# EAGLE design roomautomationfinal (EAGLE 8.2.2)
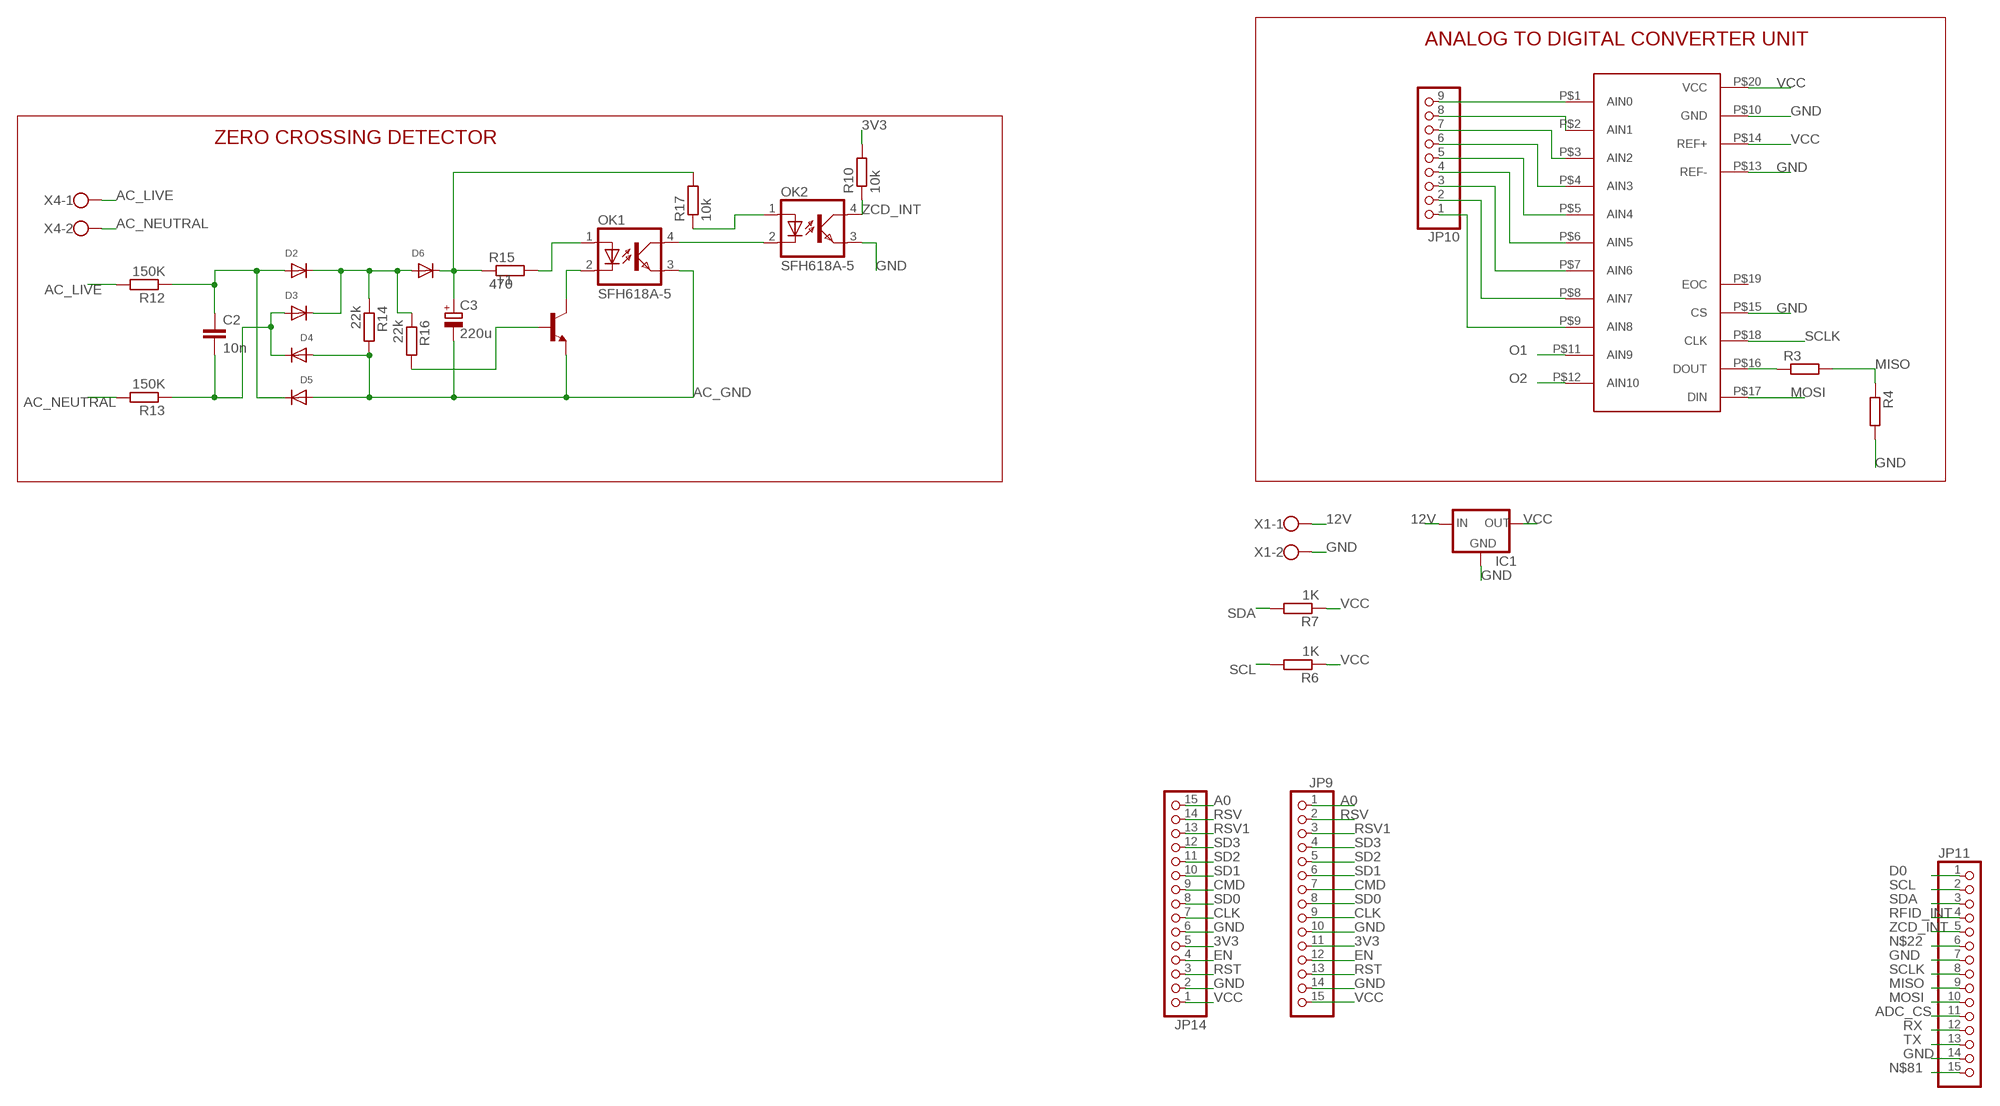
[diagram p0: schematic, sheet 1, part 1 of 2]
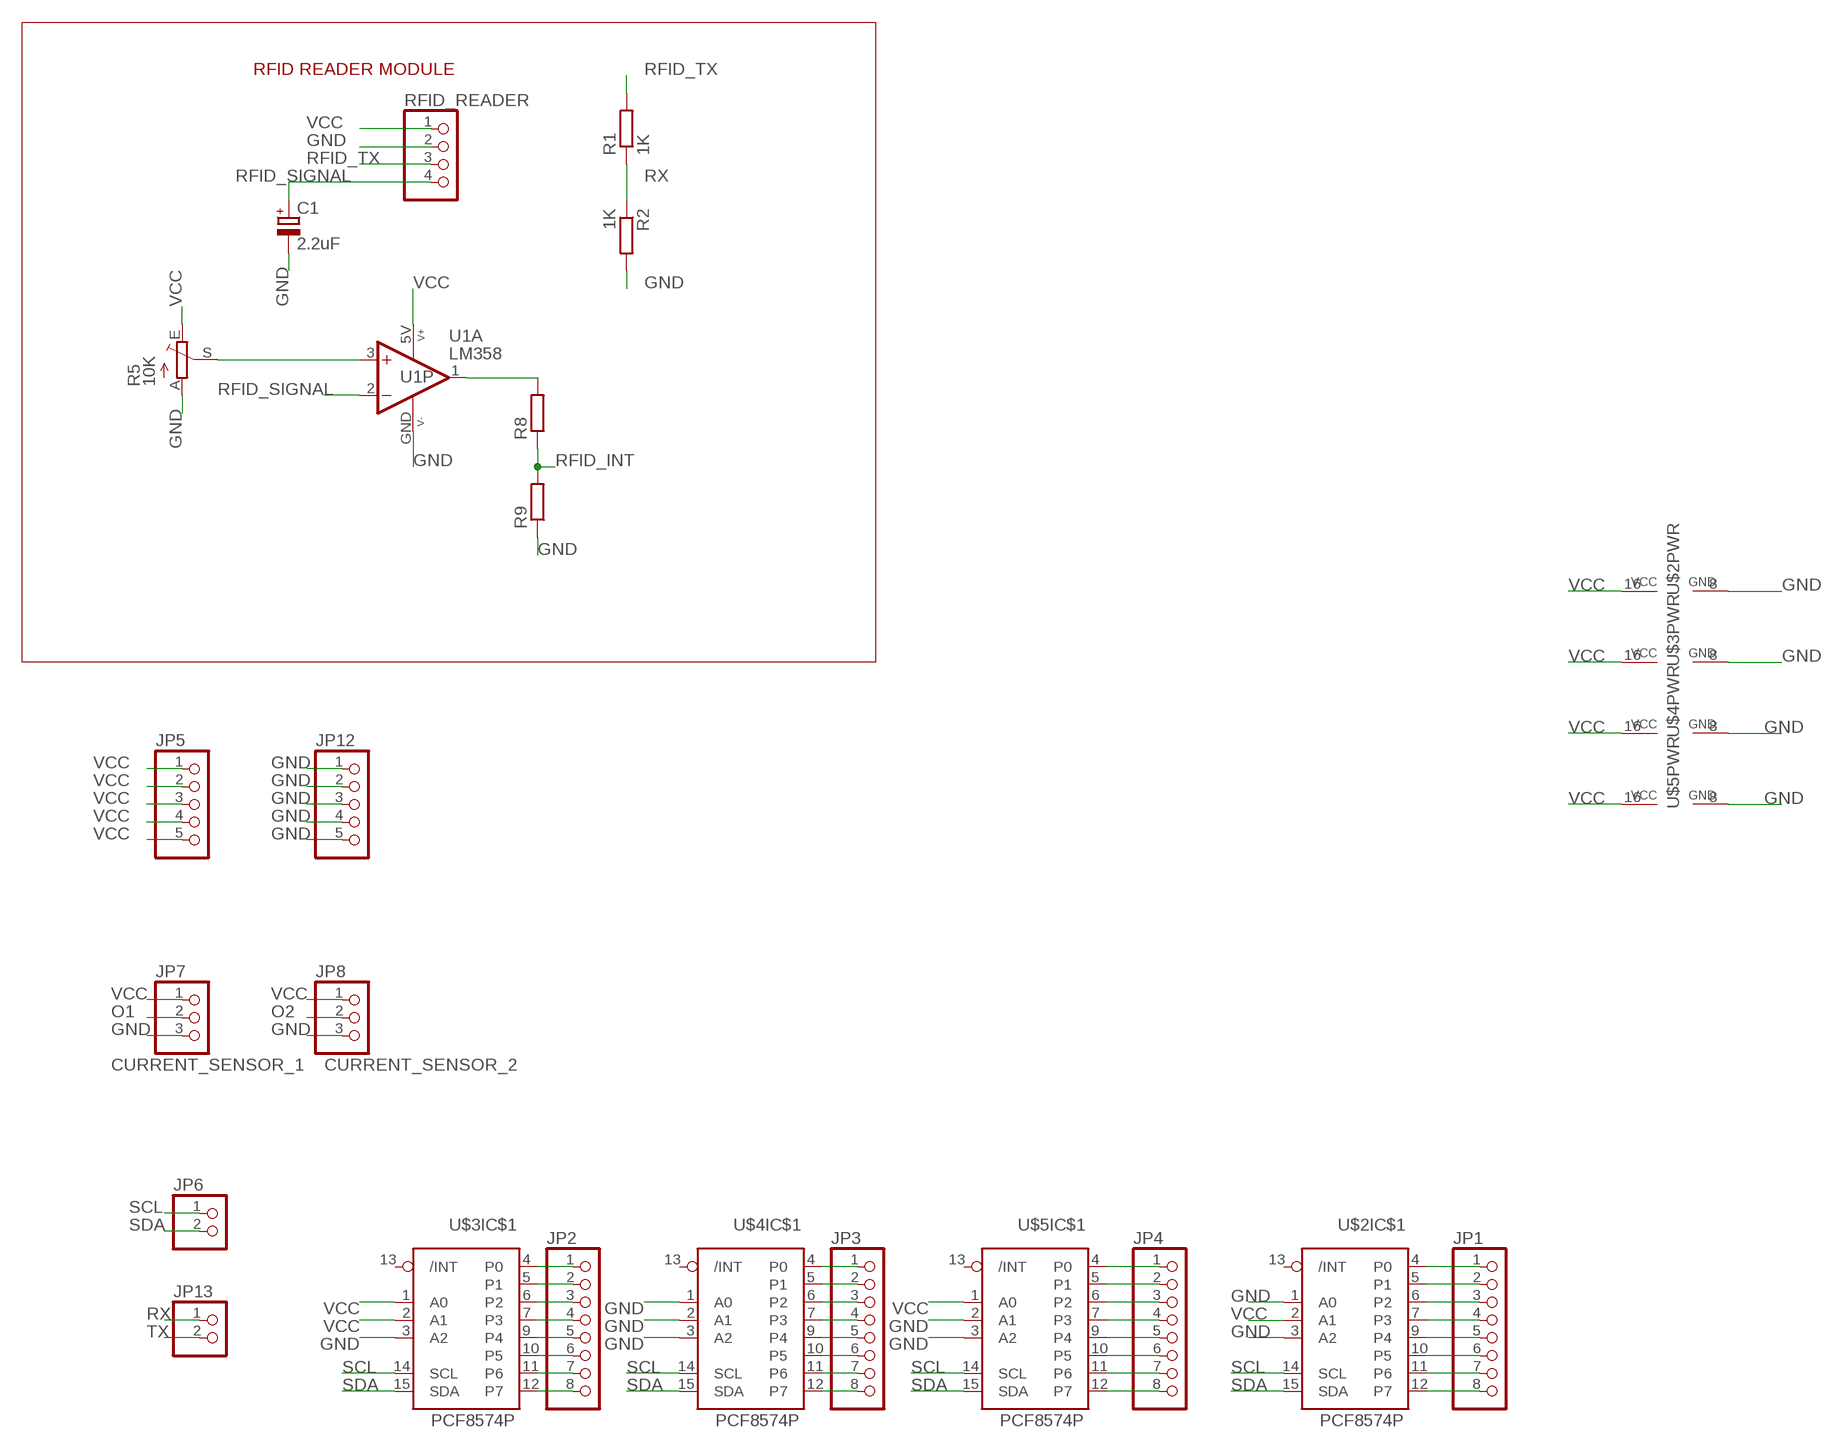
[diagram p1: schematic, sheet 1, part 2 of 2]

## Parts
C1  2.2uF  CPOL-EUE2.5-5  [E2,5-5]
C2  10n  C-EU150-054X183  [C150-054X183]
C3  220u  CPOL-EUE5-10.5  [E5-10,5]
D2  DIODEDO-1N4148  [DO-1N4148]
D3  DIODEDO-1N4148  [DO-1N4148]
D4  DIODEDO-1N4148  [DO-1N4148]
D5  DIODEDO-1N4148  [DO-1N4148]
D6  DIODEDO-1N4148  [DO-1N4148]
IC1  78MXXS  [78MXXS]
JP1  HEADER-1X8  [1X08_OVAL]
JP2  HEADER-1X8  [1X08_OVAL]
JP3  HEADER-1X8  [1X08_OVAL]
JP4  HEADER-1X8  [1X08_OVAL]
JP5  PINHD-1X5  [1X05]
JP6  PINHD-1X2  [1X02]
JP7  PINHD-1X3  [1X03]
JP8  PINHD-1X3  [1X03]
JP9  PINHD-1X15  [1X15]
JP10  PINHD-1X9  [1X09]
JP11  PINHD-1X15  [1X15]
JP12  PINHD-1X5  [1X05]
JP13  PINHD-1X2  [1X02]
JP14  PINHD-1X15  [1X15]
OK1  SFH618A-5  [DIP4]
OK2  SFH618A-5  [DIP4]
R1  1K  R-EU_0207/10  [0207/10]
R2  1K  R-EU_0207/10  [0207/10]
R3  R-EU_0207/10  [0207/10]
R4  R-EU_0207/10  [0207/10]
R5  10K  TRIM_EU-B25P  [B25P]
R6  1K  R-EU_0207/10  [0207/10]
R7  1K  R-EU_0207/10  [0207/10]
R8  R-EU_0207/10  [0207/10]
R9  R-EU_0207/10  [0207/10]
R10  10k  R-EU_0207/10  [0207/10]
R12  150K  R-EU_0207/10  [0207/10]
R13  150K  R-EU_0207/10  [0207/10]
R14  22k  R-EU_0207/10  [0207/10]
R15  470  R-EU_0617/5V  [0617V]
R16  22k  R-EU_0207/10  [0207/10]
R17  10k  R-EU_0617/5V  [0617V]
RFID_READER  HEADER-1X4  [1X04_OVAL]
T1  -NPN-TO92-CBE  [TO92-CBE]
U1  LM358  NE5532N  [DIL08]
U$2  PCF8574P  [DIL16]
U$3  PCF8574P  [DIL16]
U$4  PCF8574P  [DIL16]
U$5  PCF8574P  [DIL16]
U$6  TLC2543  [TLC2543]
X1  W237-102  [W237-102]
X4  W237-102  [W237-102]

## Nets
3V3: JP9.11 JP14.5 R10.2
12V: IC1.IN X1.1
A0: JP9.1 JP14.15
AC_GND: C3.- D4.A D5.A OK1.3(EMIT) R14.2 T1.E
AC_LIVE: R12.2 X4.1
AC_NEUTRAL: R13.2 X4.2
ADC_CS: JP11.11
CLK: JP9.9 JP14.7
CMD: JP9.7 JP14.9
D0: JP11.1
EN: JP9.12 JP14.4
GND: C1.- IC1.GND JP7.3 JP8.3 JP9.10 JP9.14 JP11.7 JP11.14 JP12.1 JP12.2 JP12.3 JP12.4 JP12.5 JP14.2 JP14.6 OK2.3(EMIT) R2.2 R4.2 R5.A R9.1 RFID_READER.2 U1.GND(P:V-) U$2.1(IC$1:A0) U$2.3(IC$1:A2) U$2.8(PWR:GND) U$3.3(IC$1:A2) U$3.8(PWR:GND) U$4.1(IC$1:A0) U$4.2(IC$1:A1) U$4.3(IC$1:A2) U$4.8(PWR:GND) U$5.2(IC$1:A1) U$5.3(IC$1:A2) U$5.8(PWR:GND) U$6.P$10(GND) U$6.P$13(REF-) U$6.P$15(CS) X1.2
MISO: JP11.9 R3.2 R4.1
MOSI: JP11.10 U$6.P$17(DIN)
N$2: R3.1 U$6.P$16(DOUT)
N$5: JP10.9 U$6.P$1(AIN0)
N$6: JP10.8 U$6.P$2(AIN1)
N$7: JP10.7 U$6.P$3(AIN2)
N$8: JP10.6 U$6.P$4(AIN3)
N$9: JP10.5 U$6.P$5(AIN4)
N$10: JP10.4 U$6.P$6(AIN5)
N$11: JP10.3 U$6.P$7(AIN6)
N$12: JP10.2 U$6.P$8(AIN7)
N$13: JP10.1 U$6.P$9(AIN8)
N$16: C2.1 D2.A D5.C R12.1
N$18: C2.2 D3.A D4.C R13.1
N$19: R5.S U1.3(A:+IN)
N$21: D2.C D3.C D6.A R14.1 R16.1
N$22: JP11.6
N$24: R8.2 U1.1(A:OUT)
N$25: JP1.1 U$2.4(IC$1:P0)
N$27: JP1.2 U$2.5(IC$1:P1)
N$28: JP1.3 U$2.6(IC$1:P2)
N$29: C3.+ D6.C R15.1 R17.2
N$30: JP1.4 U$2.7(IC$1:P3)
N$31: JP1.5 U$2.9(IC$1:P4)
N$32: JP1.6 U$2.10(IC$1:P5)
N$33: R16.2 T1.B
N$34: JP1.7 U$2.11(IC$1:P6)
N$35: JP1.8 U$2.12(IC$1:P7)
N$36: JP2.1 U$3.4(IC$1:P0)
N$37: JP2.2 U$3.5(IC$1:P1)
N$38: JP2.3 U$3.6(IC$1:P2)
N$39: JP2.4 U$3.7(IC$1:P3)
N$40: JP2.5 U$3.9(IC$1:P4)
N$41: JP2.6 U$3.10(IC$1:P5)
N$42: JP2.7 U$3.11(IC$1:P6)
N$43: JP2.8 U$3.12(IC$1:P7)
N$44: JP3.1 U$4.4(IC$1:P0)
N$45: JP3.2 U$4.5(IC$1:P1)
N$46: JP3.3 U$4.6(IC$1:P2)
N$47: JP3.4 U$4.7(IC$1:P3)
N$48: JP3.5 U$4.9(IC$1:P4)
N$49: JP3.6 U$4.10(IC$1:P5)
N$50: JP3.7 U$4.11(IC$1:P6)
N$51: JP3.8 U$4.12(IC$1:P7)
N$52: JP4.1 U$5.4(IC$1:P0)
N$53: JP4.2 U$5.5(IC$1:P1)
N$54: JP4.3 U$5.6(IC$1:P2)
N$55: JP4.4 U$5.7(IC$1:P3)
N$56: JP4.5 U$5.9(IC$1:P4)
N$57: JP4.6 U$5.10(IC$1:P5)
N$58: JP4.7 U$5.11(IC$1:P6)
N$59: JP4.8 U$5.12(IC$1:P7)
N$65: OK2.1(A) R17.1
N$66: OK1.4(COL) OK2.2(C)
N$69: OK1.1(A) R15.2
N$70: OK1.2(C) T1.C
N$81: JP11.15
O1: JP7.2 U$6.P$11(AIN9)
O2: JP8.2 U$6.P$12(AIN10)
RFID_INT: JP11.4 R8.1 R9.2
RFID_SIGNAL: C1.+ RFID_READER.4 U1.2(A:-IN)
RFID_TX: R1.2 RFID_READER.3
RST: JP9.13 JP14.3
RSV: JP9.2 JP14.14
RSV1: JP9.3 JP14.13
RX: JP11.12 JP13.1 R1.1 R2.1
SCL: JP6.1 JP11.2 R6.2 U$2.14(IC$1:SCL) U$3.14(IC$1:SCL) U$4.14(IC$1:SCL) U$5.14(IC$1:SCL)
SCLK: JP11.8 U$6.P$18(CLK)
SD0: JP9.8 JP14.8
SD1: JP9.6 JP14.10
SD2: JP9.5 JP14.11
SD3: JP9.4 JP14.12
SDA: JP6.2 JP11.3 R7.2 U$2.15(IC$1:SDA) U$3.15(IC$1:SDA) U$4.15(IC$1:SDA) U$5.15(IC$1:SDA)
TX: JP11.13 JP13.2
VCC: IC1.OUT JP5.1 JP5.2 JP5.3 JP5.4 JP5.5 JP7.1 JP8.1 JP9.15 JP14.1 R5.E R6.1 R7.1 RFID_READER.1 U1.5V(P:V+) U$2.2(IC$1:A1) U$2.16(PWR:VCC) U$3.1(IC$1:A0) U$3.2(IC$1:A1) U$3.16(PWR:VCC) U$4.16(PWR:VCC) U$5.1(IC$1:A0) U$5.16(PWR:VCC) U$6.P$14(REF+) U$6.P$20(VCC)
ZCD_INT: JP11.5 OK2.4(COL) R10.1
Unconnected: U1.5(B:+IN) U1.6(B:-IN) U1.7(B:OUT) U$2.13(IC$1:/INT) U$3.13(IC$1:/INT) U$4.13(IC$1:/INT) U$5.13(IC$1:/INT) U$6.P$19(EOC)

## Notes on the sheet
- ANALOG TO DIGITAL CONVERTER UNIT
- RFID READER MODULE
- ZERO CROSSING DETECTOR
- CURRENT_SENSOR_1 | CURRENT_SENSOR_2

## Library data of the parts
C1 = resistor:CPOL-EU: POLARIZED CAPACITOR, European symbol
C2 = rcl:C-EU: CAPACITOR, European symbol
C3 = rcl:CPOL-EU: POLARIZED CAPACITOR, European symbol
D2-D6 = adafruit:DIODE: Diode SMADIODE - SMA Surface Mount Package 20V 1A Schottky Diode Digikey: 641-1014-6-ND DO-1N4148 - Through Hole Small Current Diode SOD-123 20V 1 A (.5mV Vf) Schottky Diode - Digikey: MBRX120TPMSCT-ND SOD-323 10V 570mA (.38mV Vf, 3ns) Schottky Diode - Digikey: ZLLS410CT-ND SOD-523 30V 30mA Schottky Diode (RB751S-40TE61) - Digikey: RB751S-40TE61CT-ND SOT23-R/W - SOT23 Package (R = Solder Paste/Reflow Ovens, W = Hand-Soldering) BAT54Film 40V 300mA - Digikey: 497-7162-1-ND
IC1 = v-reg-3:78MXXS: VOLTAGE REGULATOR
JP1-JP4 = microbuilder:HEADER-1X8: PIN HEADER
JP5 JP12 = pinhead:PINHD-1X5: PIN HEADER
JP6 JP13 = pinhead:PINHD-1X2: PIN HEADER
JP7 JP8 = adafruit:PINHD-1X3: PIN HEADER
JP9 = adafruit:PINHD-1X15: PIN HEADER
JP10 = pinhead:PINHD-1X9: PIN HEADER
JP11 JP14 = pinhead:PINHD-1X15: PIN HEADER
OK1 OK2 = optocoupler:SFH618?*: Optocoupler, Phototransistor Output, Low Input Current Source: Data sheet <http://www.vishay.com/docs/83673/sfh618.pdf>; MF: VISHAY/TELEFUNKEN; MPN: SFH618A-5; OC_FARNELL: 1469593; OC_NEWARK: 59K0259
R1-R4 R6-R10 R12-R17 = rcl:R-EU_: RESISTOR, European symbol
R5 = pot:TRIM_EU-: POTENTIOMETER
RFID_READER = microbuilder:HEADER-1X4: PIN HEADER
T1 = transistor-neu-to92:*-NPN-: NPN Transistror
U1 = op-amp:NE5532: OP-AMP
U$2-U$5 = i2c:PCF8574: Remote 8-Bit I/O Expander for I²C Bus
U$6 = TLC2543:TLC2543
X1 X4 = con-wago-500:W237-102: WAGO SCREW CLAMP; MPN: 237-102; OC_FARNELL: unknown; OC_NEWARK: 70K9898

## Board
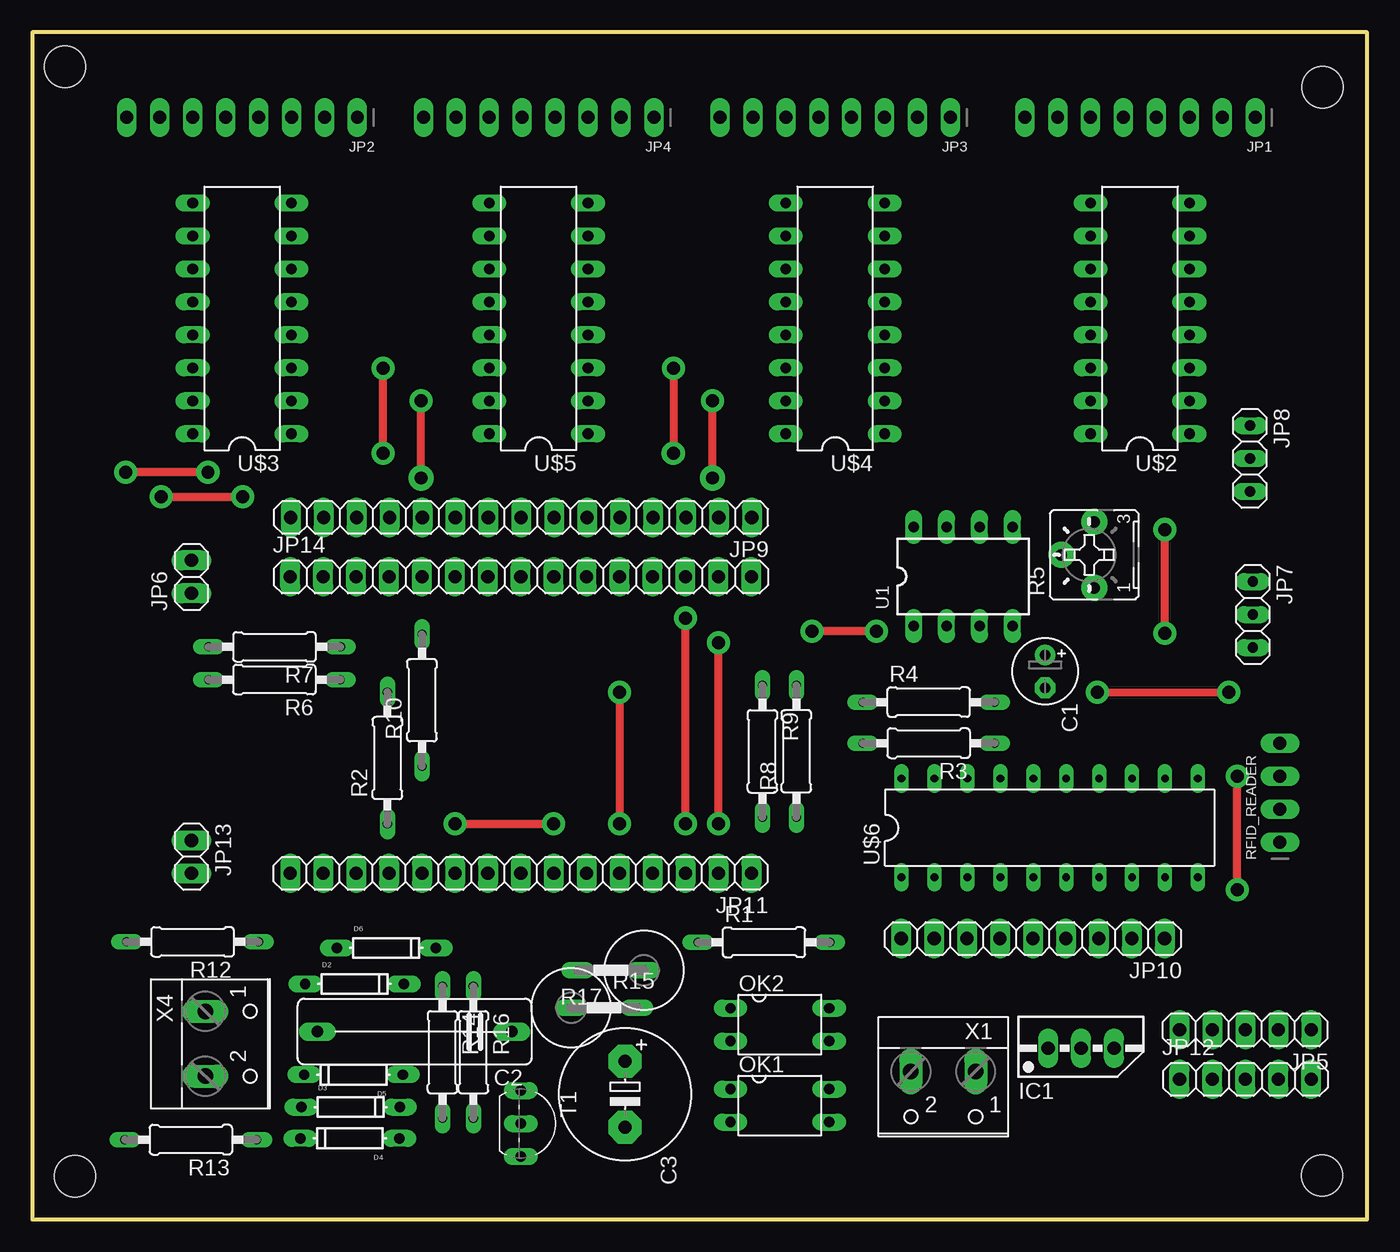
[diagram p2: board, top side]
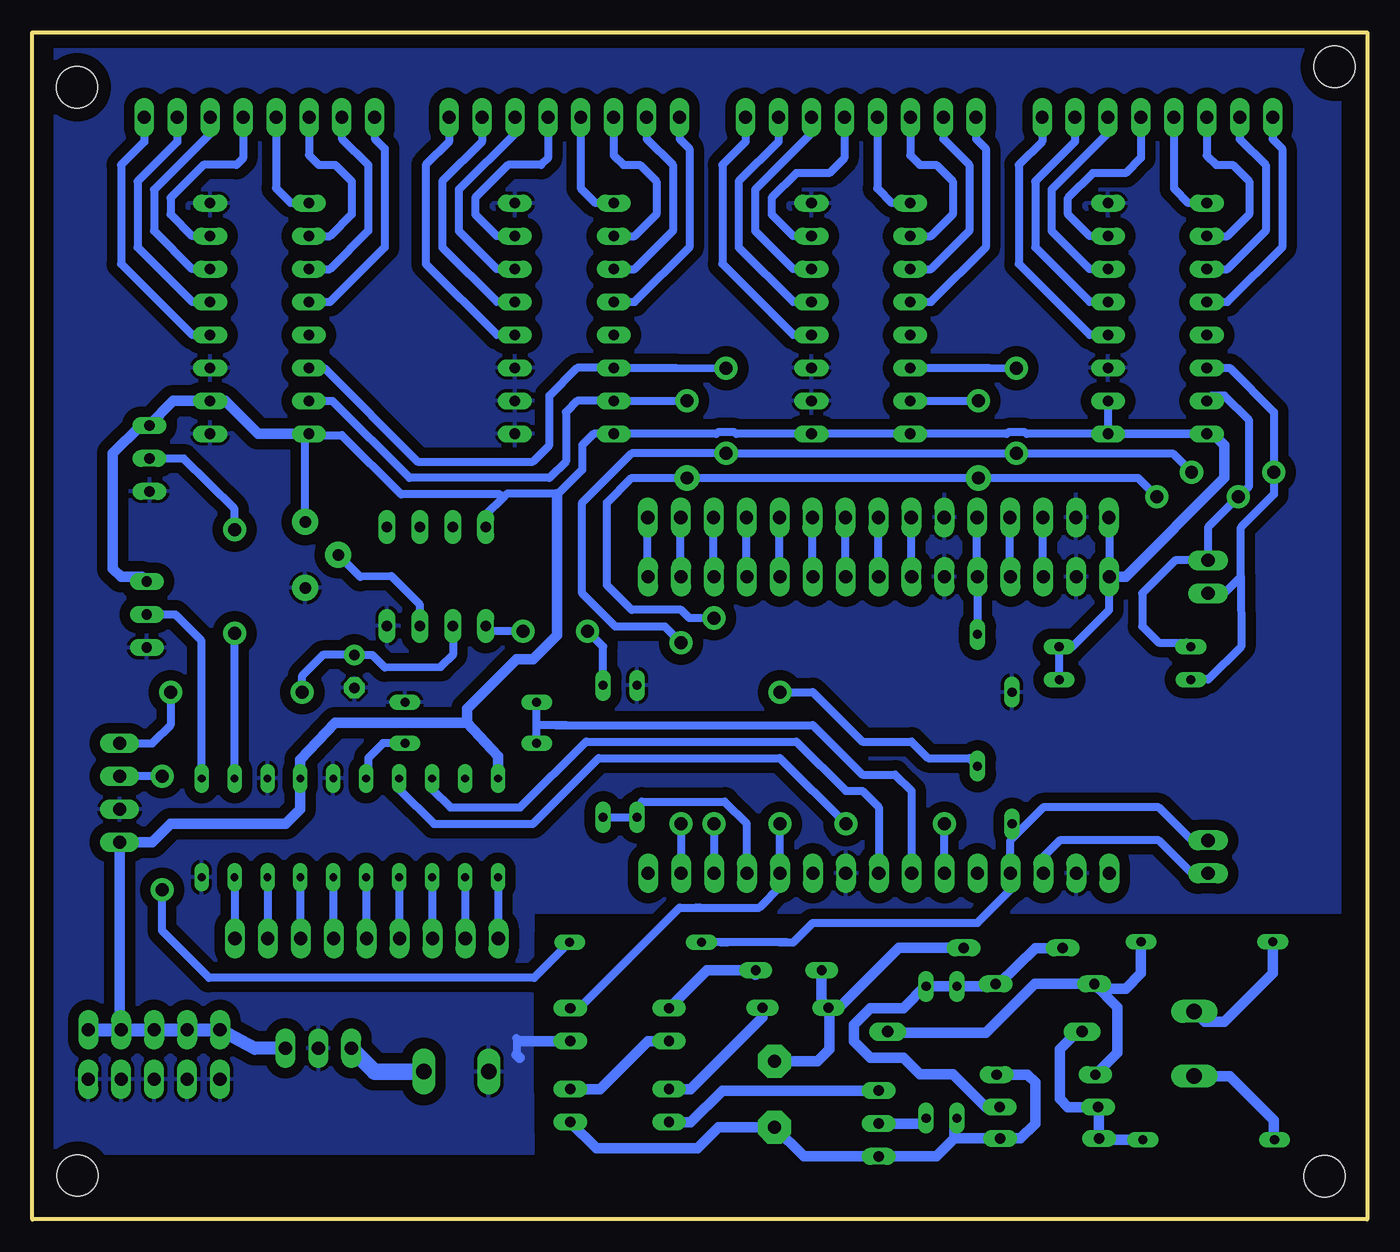
[diagram p3: board, bottom side, seen from below]

Size 102.93 x 91.5 mm. Coordinates in mm from the lower left corner, seen from the top.
Outline: 0,0 102.93,0 102.93,91.5 0,91.5 0,0
Copper layers (1*16): Top 0.035mm / dielectric 1.5mm / Bottom 0.035mm
Design rules "default *": minimum track width 6mil, minimum drill 0.35mm, track to track 16mil, track to pad 16mil, pad to pad 16mil, via to via 16mil, smd to smd 16mil, copper to edge 40mil, drill to drill 50mil, minimum pad ring 10mil, minimum via ring 8mil, stop-mask expansion 4mil, vias tented up to drill 0mil, thermal gap 10mil
Holes 3.2 mm at 99.5,87.27 99.46,3.37 2.5,88.86 3.29,3.33

### Footprints (pad centres in the part's own frame; a part is rotated, then mirrored left to right if it is on the bottom)
E2,5-5 = drill 0.813 pad 1.6: + -1.27,0 | drill 0.813 pad 1.6 octagon: - 1.27,0
C150-054X183 = drill 0.9 long: 1 -7.493,0; 2 7.493,0
E5-10,5 = drill 1.016 pad 2.54 octagon: + -2.54,0; - 2.54,0
DO-1N4148 = drill 0.8 long: A -3.81,0; C 3.81,0
78MXXS = drill 1.016 long: GND 0,-2.54; IN -2.54,-2.54; OUT 2.54,-2.54
1X08_OVAL = drill 1 long: 1 -8.89,0; 2 -6.35,0; 3 -3.81,0; 4 -1.27,0; 5 1.27,0; 6 3.81,0; 7 6.35,0; 8 8.89,0
1X05 = drill 1.016 long: 1 -5.08,0; 2 -2.54,0; 3 0,0; 4 2.54,0; 5 5.08,0
1X02 = drill 1.016 long: 1 -1.27,0; 2 1.27,0
1X03 = drill 0.8 long: 1 -2.54,0; 2 0,0; 3 2.54,0
1X15 = drill 1.016 long: 1 -17.78,0; 2 -15.24,0; 3 -12.7,0; 4 -10.16,0; 5 -7.62,0; 6 -5.08,0; 7 -2.54,0; 8 0,0; 9 2.54,0; 10 5.08,0; 11 7.62,0; 12 10.16,0; 13 12.7,0; 14 15.24,0; 15 17.78,0
1X09 = drill 1.016 long: 1 -10.16,0; 2 -7.62,0; 3 -5.08,0; 4 -2.54,0; 5 0,0; 6 2.54,0; 7 5.08,0; 8 7.62,0; 9 10.16,0
DIP4 = drill 0.8 long: 1 -1.27,-3.81; 2 1.27,-3.81; 3 1.27,3.81; 4 -1.27,3.81
0207/10 = drill 0.7 long: 1 -5.08,0; 2 5.08,0
B25P = drill 0.9 pad 2: A -2.54,0; E 2.54,0; S 0,2.54
0617V = drill 0.75 long: 1 -2.54,0; 2 2.54,0
1X04_OVAL = drill 1 long: 1 -3.81,0; 2 -1.27,0; 3 1.27,0; 4 3.81,0
TO92-CBE = drill 0.813 long: B 0,0; C -2.54,0; E 2.54,0
DIL08 = drill 0.813 long: 1 -3.81,-3.81; 2 -1.27,-3.81; 3 1.27,-3.81; 5 3.81,3.81; 5V -3.81,3.81; 6 1.27,3.81; 7 -1.27,3.81; GND 3.81,-3.81
DIL16 = drill 0.813 long: 1 -8.89,-3.81; 2 -6.35,-3.81; 3 -3.81,-3.81; 4 -1.27,-3.81; 5 1.27,-3.81; 6 3.81,-3.81; 7 6.35,-3.81; 8 8.89,-3.81; 9 8.89,3.81; 10 6.35,3.81; 11 3.81,3.81; 12 1.27,3.81; 13 -1.27,3.81; 14 -3.81,3.81; 15 -6.35,3.81; 16 -8.89,3.81
TLC2543 = drill 0.6 long: P$1 -8.89,-3.81; P$2 -6.35,-3.81; P$3 -3.81,-3.81; P$4 -1.27,-3.81; P$5 1.27,-3.81; P$6 3.81,-3.81; P$7 6.35,-3.81; P$8 8.89,-3.81; P$9 11.43,-3.81; P$10 13.97,-3.81; P$11 13.97,3.81; P$12 11.43,3.81; P$13 8.89,3.81; P$14 6.35,3.81; P$15 3.81,3.81; P$16 1.27,3.81; P$17 -1.27,3.81; P$18 -3.81,3.81; P$19 -6.35,3.81; P$20 -8.89,3.81
W237-102 = drill 1.194 long: 1 -2.5,-1.27; 2 2.5,-1.27

### Placement (x,y rotation side)
C1  78.1,42.24 270 top
C2  29.48,14.47 180 top
C3  45.7,9.64 270 top
D2  24.84,18.14 0 top
D3  24.54,8.65 0 top
D4  24.48,6.24 180 top
D5  24.77,11.14 180 top
D6  27.29,20.92 0 top
IC1  80.88,15.72 0 top
JP1  85.42,84.95 180 top
JP2  16.17,84.95 180 top
JP3  61.91,84.95 180 top
JP4  39.04,84.95 180 top
JP5  93.55,14.6 180 top
JP6  12.27,49.53 90 top
JP7  94.11,46.62 270 top
JP8  93.89,58.66 270 top
JP9  37.7,54.11 180 top
JP10  77.16,21.64 180 top
JP11  37.66,26.67 180 top
JP12  93.55,10.79 0 top
JP13  12.27,27.94 270 top
JP14  37.66,49.53 0 top
OK1  57.65,8.76 270 top
OK2  57.65,15.01 270 top
R1  56.41,21.36 0 top
R2  27.38,35.56 90 top
R3  69.11,36.7 180 top
R4  69.11,39.88 0 top
R5  81.89,51.22 90 top
R6  18.66,41.61 180 top
R7  18.67,44.13 180 top
R8  58.91,36.08 90 top
R9  56.29,36.08 270 top
R10  30.04,40.02 90 top
R12  12.35,21.39 180 top
R13  12.21,6.13 180 top
R14  31.62,12.88 270 top
R15  44.09,16.31 0 top
R16  34,12.88 270 top
R17  44.61,19.2 180 top
RFID_READER  96.2,32.88 90 top
T1  37.66,7.38 270 top
U1  71.78,49.56 0 top
U$2  85.42,69.45 90 top
U$3  16.17,69.45 90 top
U$4  61.91,69.45 90 top
U$5  39.04,69.45 90 top
U$6  75.92,30.18 0 top
X1  70.25,10.12 180 top
X4  14.6,13.53 270 top

### Tracks (layer width: path | path; a pad name or v marks a point on that pad's centre or on a via)
3V3
  Bottom 0.61: 30.05,48.26 JP14.5 | JP14.5 30.07,49.53 JP9.11 | JP14.5 R10.2
12V
  Bottom 1.27: X1.1 76.54,11.39 IC1.IN
A0
  Bottom 0.61: 55.45,54.08 JP9.1 55.48,49.53 JP14.15
AC_GND
  Bottom 0.813: OK1.3 59.44,5.48 51.63,5.48 50.01,7.1 C3.- 43.44,4.84 T1.E 33.22,4.84 31.82,6.24 | D5.A 26.18,11.14 25.6,10.56 25.6,7.38 26.75,6.24 D4.A 31.82,6.24 | 31.82,6.24 31.82,7.6 R14.2
AC_LIVE
  Bottom 0.813: R12.2 7.27,18.96 11,15.24 12.53,15.24 X4.1
AC_NEUTRAL
  Bottom 0.813: X4.2 10.6,11.04 7.19,7.62 7.19,6.18 R13.2
CLK
  Bottom 0.61: JP14.7 35.16,49.53 JP9.9
CMD
  Bottom 0.61: JP14.9 40.23,49.53 JP9.7
EN
  Bottom 0.61: JP14.4 27.54,49.53 JP9.12
GND
  Bottom 0.61: 65.37,13.74 65.6,13.97 65.6,12.7
  Bottom 0.813: 65.6,12.7 65.37,12.46 | OK2.3 65.37,13.74
  pour Bottom (isolate 0.813): 2.1,90.17 101.17,90.17 101.17,5.12 65.88,5.12 64.34,5.08 arc2 64.34,23.7 2.1,23.7
MISO
  Bottom 0.61: R3.2 64.04,38.1 | 62.64,38.1 61.8,38.1 | 61.8,38.1 42.74,38.1 38.94,34.29 36.4,34.29 35.12,33.02 JP11.9 | 61.8,38.1 61.86,38.1 64.04,38.1 | 64.04,38.1 64.03,38.11 R4.1
MOSI  (via drill 1 pad 1.78)
  Top 0.61: v32.59,30.48 v40.2,30.48
  Bottom 0.61: U$6.P$17 74.64,33.17 71.95,30.48 64.34,30.48 59.26,35.56 45.28,35.56 v40.2,30.48 | JP11.10 v32.59,30.48
N$2
  Bottom 0.61: R3.1 75.89,36.7 77.03,35.56 77.03,34.14 U$6.P$16
N$5
  Bottom 0.61: U$6.P$1 67.03,21.67 JP10.9
N$6
  Bottom 0.61: U$6.P$2 69.56,21.67 JP10.8
N$7
  Bottom 0.61: U$6.P$3 72.11,21.67 JP10.7
N$8
  Bottom 0.61: U$6.P$4 74.64,21.67 JP10.6
N$9
  Bottom 0.61: U$6.P$5 77.19,21.67 JP10.5
N$10
  Bottom 0.61: U$6.P$6 79.72,21.67 JP10.4
N$11
  Bottom 0.61: U$6.P$7 82.27,21.67 JP10.3
N$12
  Bottom 0.61: U$6.P$8 84.81,21.67 JP10.2
N$13
  Bottom 0.61: U$6.P$9 87.34,21.67 JP10.1
N$16
  Bottom 0.813: C2.1 36.87,14.37 29.41,14.37 25.64,18.14 D2.A | D5.C 19.25,12.85 19.25,16.36 D2.A | R12.1 17.43,18.96 18.62,17.78 20.67,17.78 D2.A
N$18
  Bottom 0.813: C2.2 22.32,14.47 23.7,13.1 23.7,9.29 23.06,8.65 D3.A 20.67,8.59 D4.C 20.57,6.13 R13.1
N$19
  Bottom 0.61: U1.3 73.05,47.38 75.25,49.58 77.66,49.53 R5.S
N$21
  Bottom 0.813: D3.C 29.41,8.65 31.95,11.2 34.49,11.2 35.76,12.46 38.3,12.46 39.57,13.74 39.57,15.01 38.3,16.28 35.76,16.28 34,18.03 R16.1 R14.1 28.84,17.96 D2.C 28.41,18.14 25.58,20.91 23.43,20.91 D6.A
N$24  (via drill 1 pad 1.78)
  Top 0.61: v65.08,45.35 v60.12,45.35
  Bottom 0.61: 67.95,45.77 U1.1 67.57,45.35 v65.08,45.35 | v60.12,45.35 58.91,44.14 R8.2
N$25
  Bottom 0.61: JP1.1 94.31,83.06 96.08,81.28 96.08,73.66 90.61,68.18 U$2.4
N$27
  Bottom 0.61: JP1.2 91.77,83.06 94.81,80.01 94.81,74.93 90.61,70.72 U$2.5
N$28
  Bottom 0.61: JP1.3 89.22,83.69 93.55,79.38 93.55,76.2 90.61,73.26 U$2.6
N$29
  Bottom 0.813: C3.+ 42.39,12.18 41.48,13.1 41.48,16.24 R15.1 | R17.2 42.07,16.84 R15.1 | D6.C 36.11,20.92 40.72,16.31 R15.1
N$30
  Bottom 0.61: JP1.4 86.69,81.79 87.19,81.28 89.73,81.28 92.28,78.74 92.28,77.47 90.61,75.8 U$2.7
N$31
  Bottom 0.61: JP1.5 84.14,79.5 82.98,78.34 U$2.9
N$32
  Bottom 0.61: JP1.6 81.61,82.04 80.84,81.28 79.58,81.28 78.31,80.01 78.31,77.47 79.97,75.8 U$2.10
N$33
  Bottom 0.813: T1.B 34,7.38 R16.2
N$34
  Bottom 0.61: JP1.7 79.06,83.31 77.03,81.28 77.03,76.2 79.97,73.26 U$2.11
N$35
  Bottom 0.61: JP1.8 76.53,83.31 75.77,82.55 75.77,74.93 79.97,70.72 U$2.12
N$36
  Bottom 0.61: JP2.1 25.06,83.09 26.87,81.28 26.87,73.66 21.39,68.18 U$3.4
N$37
  Bottom 0.61: JP2.2 22.52,83.09 25.6,80.01 25.6,74.93 21.39,70.72 U$3.5
N$38
  Bottom 0.61: U$3.6 21.39,73.26 24.33,76.2 24.33,79.38 19.98,83.72 JP2.3
N$39
  Bottom 0.61: JP2.4 17.44,81.82 18.62,80.64 21.16,80.64 23.06,78.74 23.06,77.47 21.39,75.8 U$3.7
N$40
  Bottom 0.61: JP2.5 14.9,79.47 13.77,78.34 U$3.9
N$41
  Bottom 0.61: JP2.6 12.36,82.01 11.63,81.28 10.36,81.28 9.09,80.01 9.09,77.47 10.76,75.8 U$3.10
N$42
  Bottom 0.61: JP2.7 9.82,83.28 7.82,81.28 7.82,76.2 10.76,73.26 U$3.11
N$43
  Bottom 0.61: JP2.8 7.28,83.28 6.55,82.55 6.55,74.93 10.76,70.72 U$3.12
N$44
  Bottom 0.61: JP3.1 70.8,83.07 72.59,81.28 72.59,73.66 67.11,68.18 U$4.4
N$45
  Bottom 0.61: JP3.2 68.26,83.07 71.32,80.01 71.32,74.93 67.11,70.72 U$4.5
N$46
  Bottom 0.61: U$4.6 67.11,73.26 70.05,76.2 70.05,79.38 65.6,83.82 65.6,84.83 JP3.3
N$47
  Bottom 0.61: JP3.4 63.18,81.8 63.7,81.28 66.24,81.28 68.78,78.74 68.78,77.47 67.11,75.8 U$4.7
N$48
  Bottom 0.61: JP3.5 60.64,79.49 59.49,78.34 U$4.9
N$49
  Bottom 0.61: JP3.6 58.1,82.03 57.35,81.28 56.08,81.28 54.81,80.01 54.81,77.47 56.48,75.8 U$4.10
N$50
  Bottom 0.61: JP3.7 55.56,83.3 53.54,81.28 53.54,76.2 56.48,73.26 U$4.11
N$51
  Bottom 0.61: JP3.8 53.02,83.3 52.27,82.55 52.27,74.93 56.48,70.72 U$4.12
N$52
  Bottom 0.61: JP4.1 47.93,83.08 49.73,81.28 49.73,73.66 44.25,68.18 U$5.4
N$53
  Bottom 0.61: JP4.2 45.39,83.08 48.46,80.01 48.46,74.93 44.25,70.72 U$5.5
N$54
  Bottom 0.61: JP4.3 42.85,83.72 47.19,79.38 47.19,76.2 44.25,73.26 U$5.6
N$55
  Bottom 0.61: JP4.4 40.31,81.81 41.48,80.64 44.02,80.64 45.92,78.74 45.92,77.47 44.25,75.8 U$5.7
N$56
  Bottom 0.61: JP4.5 37.77,79.48 36.63,78.34 U$5.9
N$57
  Bottom 0.61: JP4.6 35.23,82.02 34.49,81.28 33.22,81.28 31.95,80.01 31.95,77.47 33.62,75.8 U$5.10
N$58
  Bottom 0.61: JP4.7 32.69,83.29 30.68,81.28 30.68,76.2 33.62,73.26 U$5.11
N$59
  Bottom 0.61: JP4.8 30.15,83.29 29.41,82.55 29.41,74.93 33.62,70.72 U$5.12
N$65
  Bottom 0.813: 47.15,18.86 R17.1 50.91,19.2 OK2.1
N$66
  Bottom 0.813: OK1.4 59.14,10.04 55.44,13.74 OK2.2
N$69
  Bottom 0.813: R15.2 46.62,15.57 52.16,10.04 OK1.1
N$70
  Bottom 0.813: T1.C 49.73,9.92 52.16,7.49 OK1.2
O1
  Bottom 0.61: U$6.P$11 89.89,44.6 91.89,46.62 93.36,46.62 JP7.2
O2  (via drill 1 pad 1.78)
  Top 0.61: v87.34,45.18 v87.34,53.18
  Bottom 0.61: U$6.P$12 v87.34,45.18 | v87.34,53.18 87.34,54.76 91.25,58.65 JP8.2
RFID_INT
  Bottom 0.61: JP11.4 47.83,30.48 49.54,32.19 55.92,32.19 R9.2 R8.1
RFID_SIGNAL  (via drill 1 pad 1.78)
  Top 0.61: v82.11,40.64 v92.28,40.64
  Bottom 0.61: v92.28,40.64 92.28,38.1 93.69,36.69 RFID_READER.4 | U1.2 70.51,43.52 71.44,42.59 75.77,42.54 76.73,43.51 C1.+ 80.52,43.51 82.11,41.91 v82.11,40.64
RFID_TX  (via drill 1 pad 1.78)
  Top 0.61: v92.91,25.4 v92.91,34.15
  Bottom 0.61: v92.91,25.4 92.93,22.25 89.31,18.61 64.24,18.61 R1.2 | v92.91,34.15 RFID_READER.3
RST
  Bottom 0.61: JP14.3 25,49.53 JP9.13
RSV
  Bottom 0.61: JP14.14 52.94,49.53 JP9.2
RSV1
  Bottom 0.61: JP14.13 50.4,49.53 JP9.3
RX
  Bottom 0.61: 27.38,29.34 24.96,31.75 16.07,31.75 13.54,29.21 JP13.1 | R1.1 49.33,21.36 49.79,21.36 45.28,21.36 | R2.1 27.38,29.34 | 27.38,29.34 27.5,29.21 JP11.12 27.5,25.4 30.05,22.86 42.74,22.86 44.25,21.36 45.28,21.36 | 44.71,21.36 45.28,21.36
SCL  (via drill 1 pad 1.78, 1 pad 1.79)
  Top 0.61: v27.04,59.05 v27.04,65.61 | v49.42,65.61 v49.42,59.05 | v52.91,30.48 v52.91,44.45 | v13.54,57.59 v7.19,57.59
  Bottom 0.61: U$5.14 29.18,65.64 v27.04,65.61 | U$2.14 80.44,65.64 73.22,58.42 64.34,58.42 63.06,59.69 63.06,63.5 60.92,65.64 U$4.14 53.3,65.64 v49.42,65.61 | v52.91,44.45 54.17,45.72 57.98,45.72 60.52,48.26 60.52,55.24 56.72,59.05 v49.42,59.05 v27.04,59.05 15,59.05 v13.54,57.59 | JP6.1 11,48.26 9.72,49.53 | 9.72,49.53 9.72,53.34 7.19,55.88 v7.19,57.59 7.19,62.23 10.59,65.64 U$3.14 | v52.91,30.48 JP11.2 | 9.72,49.53 9.71,44.16 12.26,41.62 13.27,41.62 R6.2
SCLK
  Bottom 0.61: U$6.P$18 72.11,33.17 70.69,31.75 65.3,31.75 60.22,36.83 44.02,36.83 40.2,33.02 38.94,33.02 37.66,31.75 JP11.8
SD0
  Bottom 0.61: JP14.8 37.7,49.53 JP9.8
SD1
  Bottom 0.61: JP14.10 42.77,49.53 JP9.6
SD2
  Bottom 0.61: JP14.11 45.31,49.53 JP9.5
SD3
  Bottom 0.61: JP14.12 47.85,49.53 JP9.4
SDA  (via drill 1 pad 1.78, 1 pad 1.93)
  Top 0.61: v52.44,57.15 v52.44,63.1 | v29.98,57.15 v29.98,63.1 | v50.37,30.48 v50.37,46.35 | v9.93,55.69 v16.2,55.69
  Bottom 0.61: v52.44,63.1 U$4.15 60.92,63.1 61.8,62.23 61.8,58.42 63.06,57.15 73.86,57.15 79.81,63.1 U$2.15 | U$5.15 v29.98,63.1 | v9.91,55.69 12.27,53.34 JP6.2 14.8,50.8 17.34,48.26 17.34,45.72 16.07,44.45 13.91,44.45 R7.2 | v50.37,30.48 JP11.3 | v50.37,46.35 52.27,46.35 52.91,46.99 56.72,46.99 58.62,48.89 58.62,55.24 56.72,57.15 v52.44,57.15 v29.98,57.15 17.66,57.15 v16.2,55.69 | U$3.15 11.96,63.5 11,63.5 9.09,61.59 9.09,56.52 v9.91,55.69 | v9.93,55.69 v9.91,55.69
TX
  Bottom 0.61: JP13.2 13.54,26.67 16.07,29.21 23.7,29.21 24.96,27.94 JP11.13
VCC
  Bottom 0.61: U$3.2 U$3.1 | U$5.16 U$5.1 48.66,60.56 48.76,60.66 50.09,60.66 50.19,60.56 U$4.16 59.66,60.56 60.52,59.69 60.52,57.78 62.38,55.93 | 35.12,60.45 U$5.16 | U$3.1 U$3.16 12.27,60.47 | 19.91,53.37 19.89,53.34 JP14.1 | U$3.1 11.87,60.56 | 96.2,14.72 JP5.1 | 62.38,55.93 62.43,55.88 62.48,55.88 | U1.5V 67.97,54.32 66.64,55.64 | 66.64,55.64 66.36,55.93 62.38,55.93 | R5.E 81.89,60.33 82.11,60.56 U$2.16 81.61,60.45 79.06,60.45 74.5,55.88 66.88,55.88 66.64,55.64 | U$3.1 26.27,60.56 26.37,60.66 27.7,60.66 27.8,60.56 U$5.16 | R6.1 23.74,44.12 R7.1 22.74,44.13 19.89,46.99 19.89,49.48 19.84,49.53
  Bottom 0.813: U$6.P$20 67.03,35.71 69.42,38.28 | 69.42,38.28 79.58,38.28 82.27,35.41 U$6.P$14 82.27,31.6 83.39,30.48 92.28,30.48 93.69,29.07 RFID_READER.1 96.2,14.72 | 19.91,53.37 JP9.15 | 11.87,60.56 11,59.69 11,57.15 18.62,49.53 19.84,49.53 JP14.1 | 82.11,60.56 85.53,60.56 88.06,63.1 U$2.2 92.06,63.1 93.97,61.19 | 69.42,38.28 69.42,39.37 65.6,43.18 64.34,43.18 62.48,45.03 62.48,55.88 | 93.97,61.19 JP8.1 | 93.97,61.19 94.58,61.19 96.72,59.05 96.72,50.16 96.08,49.53 94.48,49.53 JP7.1
  Bottom 1.016: JP5.1 JP5.2 JP5.3 JP5.4 JP5.5 85.78,13.19 IC1.OUT
ZCD_INT  (via drill 1 pad 1.78)
  Top 0.61: v45.28,40.64 v45.28,30.48
  Bottom 0.61: v45.28,30.48 JP11.5 45.28,25.62 46.88,24.03 51.45,24.03 | 51.45,24.03 51.73,24.03 | 51.45,24.03 51.66,24.03 53.02,24.03 56.72,20.32 60.52,16.51 61.22,16.51 OK2.4 | v45.28,40.64 42.74,40.64 38.94,36.83 35.12,36.83 33.86,35.56 30.67,35.56 R10.1